# Altium project ContadorSincronico.PrjPcb
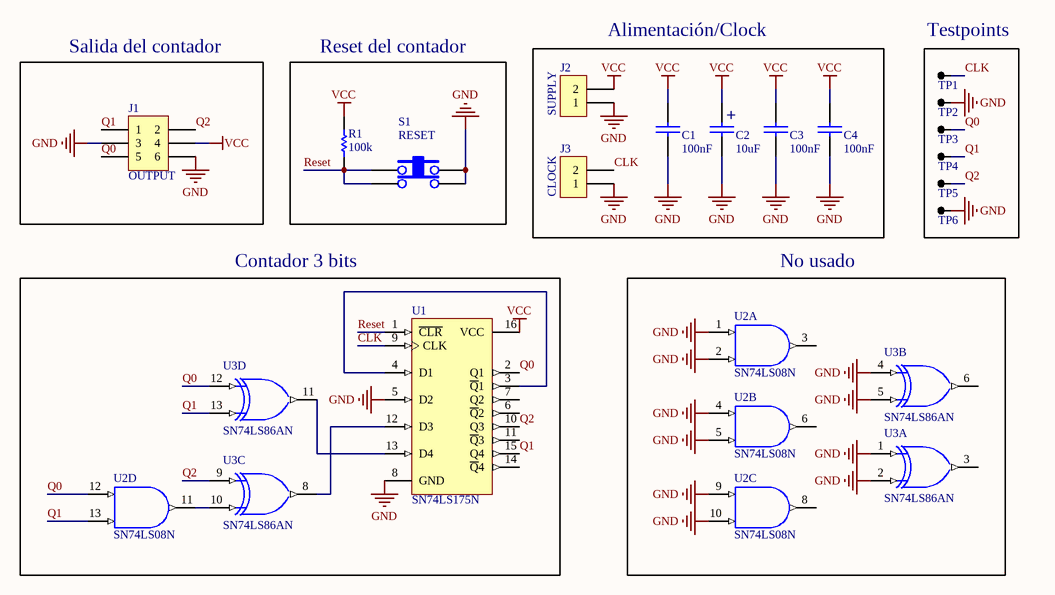
[diagram p0: ContadorSincronico_SCH.SchDoc]
1 sheet, 18 parts. Net scope: global (net labels, ports and power ports of the same name join across sheets).
Board file: ContadorSincronico_PCB.PcbDoc

## Sheet ContadorSincronico_SCH.SchDoc
size A4

### Parts
C1  100nF  [0805]
C2  10uF  [CAP100RP]
C3  100nF  [0805]
C4  100nF  [0805]
J1  OUTPUT  [SIP3*2]
J2  SUPPLY  [BORNERA2]
J3  CLOCK  [BORNERA2]
R1  100k  [0805]
S1  RESET  [TACTSWITCH]
TP1  CLK  [TPTH]  (value not drawn)
TP2  GND  [TPTH]  (value not drawn)
TP3  Q0  [TPTH]  (value not drawn)
TP4  Q1  [TPTH]  (value not drawn)
TP5  Q2  [TPTH]  (value not drawn)
TP6  GND  [TPTH]  (value not drawn)
U1  SN74LS175N  [N016]
U2  SN74LS08N  [N014]  (parts A,B,C,D of 4)
U3  SN74LS86AN  [N014]  (parts A,B,C,D of 4)

### Blocks framed on the sheet
Salida del contador: J1
Reset del contador: R1 S1
Alimentación/Clock: C1-C4 J2 J3
Testpoints: TP1-TP6
Contador 3 bits: U1-U3
No usado: U2 U3

### Nets
GND: C1.2 C2.2 C3.2 C4.2 J1.3 J1.6 J2.1 J3.1 S1.3 S1.4 TP2.1 TP6.1 U1.5(D2) U1.8(GND) U2.1(A) U2.2(B) U2.4(A) U2.5(B) U2.7(GND) U2.9(A) U2.10(B) U3.1(A) U3.2(B) U3.4(A) U3.5(B) U3.7(GND)
VCC: C1.1 C2.1 C3.1 C4.1 J1.4 J2.2 R1.1 U1.16(VCC) U2.14(VCC) U3.14(VCC)
CLK: J3.2 TP1.1 U1.9(CLK)
Q0: J1.5 TP3.1 U1.2(Q1) U2.12(A) U3.12(A)
Q1: J1.1 TP4.1 U1.15(Q4) U2.13(B) U3.13(B)
Q2: J1.2 TP5.1 U1.10(Q3) U3.9(A)
Reset: R1.2 S1.1 S1.2 U1.1(~{CLR})
NetU1_3: U1.3(~{Q}1) U1.4(D1)
NetU1_12: U1.12(D3) U3.8(Y)
NetU1_13: U1.13(D4) U3.11(Y)
NetU2_11: U2.11(Y) U3.10(B)

Not connected (* = marked no-connect by the designer): U1 6(~{Q}2) 7(Q2) 11(~{Q}3) 14(~{Q}4); U2 3(Y) 6(Y) 8(Y); U3 3(Y) 6(Y)

### Notes on the sheet
- (in symbol CAPPOL) +

### Library data of the parts
C1 C3 C4 = CAP: Value: 100nF; Footprint: SMD 0805
C2 = CAPPOL: Value: 10uF; Footprint: THT
J1 = CON3*2: Value: Pines Macho; Footprint: Pines Macho
J2 J3 = BORNERA 2: Value: BORNERA2
R1 = RES: Value: 100k; Footprint: SMD 0805
S1 = TACT SWITCH: Value: Pulsador; Footprint: THT
TP1-TP6 = TP: Value: Pin Macho; Footprint: Pin Macho
U1 = SN74LS175N: Quadruple D-Type Flip-Flop with Clear; Published: 8-Jun-2000; LatestRevisionDate: 04-Mar-2005; LatestRevisionNote: Stylized 3D Model Added.; DatasheetVersion: Mar-1988; PackageVersion: Oct-1995; PackageReference: N016; Publisher: Altium Limited; PackageDescription: DIP; 16 Leads; Row Spacing 7.62 mm; Pitch 2.54 mm; Code_JEDEC: MS-001-BB; ComponentLink1Description: Manufacturer Link; ComponentLink1URL: http://www.ti.com/; ComponentLink2Description: Datasheet; ComponentLink2URL: http://www-s.ti.com/sc/ds/sn74175.pdf
U2 = SN74LS08N: Quadruple 2-Input Positive-AND Gate; Published: 8-Jun-2000; LatestRevisionDate: 04-Mar-2005; LatestRevisionNote: Stylized 3D Model Added.; DatasheetVersion: Mar-1988; PackageVersion: Oct-1995; PackageReference: N014; Publisher: Altium Limited; PackageDescription: DIP; 14 Leads; Row Spacing 7.62 mm; Pitch 2.54 mm; ComponentLink1Description: Manufacturer Link; ComponentLink1URL: http://www.ti.com/; ComponentLink2Description: Datasheet; ComponentLink2URL: http://www-s.ti.com/sc/ds/SN74LS08.pdf
U3 = SN74LS86AN: Quadruple 2-Input Exclusive-OR Gate; Published: 8-Jun-2000; LatestRevisionDate: 04-Mar-2005; LatestRevisionNote: Stylized 3D Model Added.; DatasheetVersion: Mar-1988; PackageVersion: Oct-1995; PackageReference: N014; Publisher: Altium Limited; PackageDescription: DIP; 14 Leads; Row Spacing 7.62 mm; Pitch 2.54 mm; ComponentLink1Description: Manufacturer Link; ComponentLink1URL: http://www.ti.com/; ComponentLink2Description: Datasheet; ComponentLink2URL: http://www-s.ti.com/sc/ds/sn74ls86a.pdf